# Altium schematic sheet INOUT.SchDoc
size A
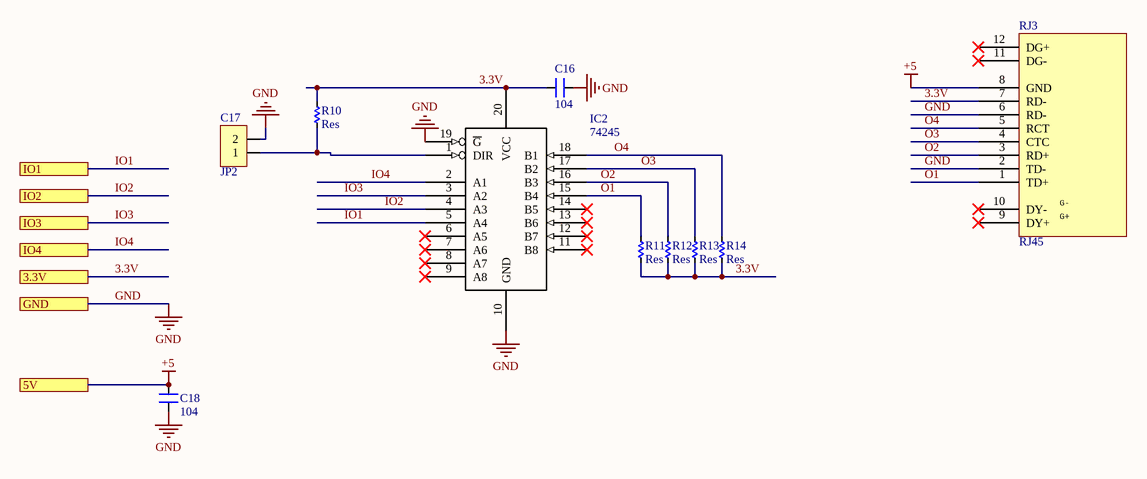
[diagram p0: INOUT.SchDoc]

## Parts
C16  104  [SM-Cap-1206]
C17  JP2  [JP2-CLOSED]
C18  104  [SM-Cap-1206]
IC2  74245  [SO20]
R10  Res  [RES-SMD-0805]
R11  Res  [RES-SMD-0805]
R12  Res  [RES-SMD-0805]
R13  Res  [RES-SMD-0805]
R14  Res  [RES-SMD-0805]
RJ3  RJ45  [RJ45-Dung]

## Ports
3.3V, 5V, GND, IO1, IO2, IO3, IO4

## Nets
+5: C18.2 RJ3.8(GND) ; port 5V
GND: C16.2 C17.2 C18.1 IC2.10(GND) IC2.19(~{G}) RJ3.2(TD-) RJ3.6(RD-) ; port GND
3.3V: C16.1 IC2.20(VCC) R10.1 R11.2 R12.2 R13.2 R14.2 RJ3.7(RD-) ; port 3.3V
IO1: IC2.5(A4) ; port IO1
IO2: IC2.4(A3) ; port IO2
IO3: IC2.3(A2) ; port IO3
IO4: IC2.2(A1) ; port IO4
O1: IC2.15(B4) R11.1 RJ3.1(TD+)
O2: IC2.16(B3) R12.1 RJ3.3(RD+)
O3: IC2.17(B2) R13.1 RJ3.4(CTC)
O4: IC2.18(B1) R14.1 RJ3.5(RCT)
NetC17_1: C17.1 IC2.1(DIR) R10.2

Not connected (* = marked no-connect by the designer): IC2 6(A5)* 7(A6)* 8(A7)* 9(A8)* 11(B8)* 12(B7)* 13(B6)* 14(B5)*; RJ3 9(DY+)* 10(DY-)* 11(DG-)* 12(DG+)*

## Notes on the sheet
- (in symbol CON JR45) G-; G+

## Library data of the parts
C16 C18 = CN: Value: 0,1uF/300V; Designed by: VanDungEvn
C17 = JP2: WR-PHD 2.54 mm Angled Socket Header; Manufacturer: W¨¹rth Elektronik eiSos GmbH; partNo: 613002143121; ComponentLink1 Description: Manufacturer; ComponentLink2 Description: Datasheet; NoPins: 02; Created Date: 29 March 2013; ComponentLink1URL: http://www.we-online.com; ComponentLink2URL: http://katalog.we-online.de/em/datasheet/6130xx143121.pdf; Created by: Karrer Zheng
IC2 = 74245: Octal bus tranceiver; 3-state; Copyright by: VanDungEvn@gmail.com
R10-R14 = Res-SMD: Resistor; Manufacturer: Generic Components; Class: Passive; Published: 08/06/2000; Publisher: Altium Hobart Technology Centre
RJ3 = CON JR45: ComponentLink1Description: Mua; ComponentLink1URL: https://thegioiic.com/products/rj45-top-cong-rj45-top-180-do